# EAGLE design THAT15xx_lean_GainPot (EAGLE 9.6.2)
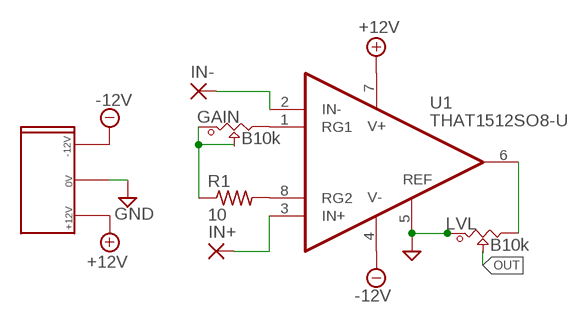
[diagram p0: schematic, sheet 1]

## Parts
GAIN  B10k  POT_9MM_SMD  [POT_9MM_SMD]
IN+  WIREPADSMD5-1,8  [5-1,8]
IN-  WIREPADSMD5-1,8  [5-1,8]
LVL  B10k  POT_9MM_SMD  [POT_9MM_SMD]
R1  10  R-US_R0603  [R0603]
U1  THAT1512SO8-U  [SO08]
U$1  EURO_POW_CEH  [EURO_POW_CEH]

## Nets
15XXO: LVL.3 U1.6(OUT)
+12V: U1.7(V+) U$1.+12V
-12V: U1.4(V-) U$1.-12V
GND: LVL.1 U1.5(REF) U$1.GND
IN+: IN+.1(P) U1.3(IN+)
IN-: IN-.1(P) U1.2(IN-)
N$1: R1.2 U1.8(RG2)
N$2: GAIN.3 U1.1(RG1)
N$3: GAIN.1 GAIN.2 R1.1
OUT: LVL.2

## Library data of the parts
GAIN LVL = Mech_BO_CE_SW:POT_9MM_SMD
IN+ IN- = wirepad:WIREPAD: Wire PAD connect wire on PCB
R1 = adafruit:R-US_: RESISTOR, American symbol
U1 = that-corp:THAT1512: Audio Preamplifier IC, Low Noise, High Performance
U$1 = 2.54mm_PowHeader_SMD:EURO_POW_CEH: Eurorack Power Header Reduced Card Edge Surface Mount Pads

## Board
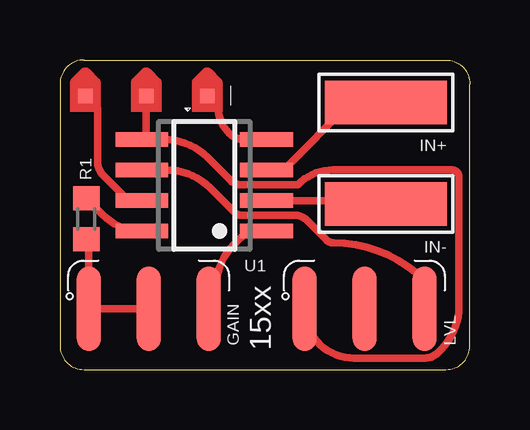
[diagram p1: board, top side]

Size 17.1 x 12.9 mm. Coordinates in mm from the lower left corner, seen from the top.
Outline: 1,12.9 16.1,12.9 arc-90 17.1,11.9 17.1,1 arc-90 16.1,0 1,0 arc-90 0,1 0,11.9 arc-90 1,12.9
Copper layers (1*16): Top 0.035mm / dielectric 1.5mm / Bottom 0.035mm
Design rules "default *": minimum track width 6mil, minimum drill 0.35mm, track to track 6mil, track to pad 6mil, pad to pad 6mil, via to via 6mil, smd to smd 6mil, copper to edge 10mil, drill to drill 6mil, minimum pad ring 10mil, minimum via ring 8mil, stop-mask expansion 4mil, vias tented up to drill 0mil, thermal gap 10mil

### Footprints (pad centres in the part's own frame; a part is rotated, then mirrored left to right if it is on the bottom)
POT_9MM_SMD = smd 0.991 x 3.505: 1 -2.5,0; 2 0,0; 3 2.5,0
5-1,8 = smd 1.829 x 5.08: 1 0,0
R0603 = smd 1 x 1.1: 1 -0.85,0; 2 0.85,0
SO08 = smd 0.6 x 2.2: 1 -1.905,-2.6; 2 -0.635,-2.6; 3 0.635,-2.6; 4 1.905,-2.6; 5 1.905,2.6; 6 0.635,2.6; 7 -0.635,2.6; 8 -1.905,2.6
EURO_POW_CEH = smd 0.6 x 0.6: +12V 0,-3.175; -12V 5.08,-3.175; GND 2.54,-3.175

### Placement (x,y rotation side)
GAIN  3.7,2.54 0 top
IN+  13.6,11.13 90 top
IN-  13.6,6.9 90 top
LVL  12.7,2.54 0 top
R1  1.1,6.28 90 top
U1  6.02,7.68 90 top
U$1  1.06,14.57 0 top

### Tracks (layer width: path | path; a pad name or v marks a point on that pad's centre or on a via)
15XXO
  Top 0.305: LVL.3 15.2,3.71 arc45 11.41,5.28 arc-45 11.11,5.4 10.28,6.24 arc45 9.78,6.44 7.52,6.44 arc-45 7.31,6.53 6.26,7.57 arc45 4.47,8.31 U1.6
+12V
  Top 0.305: U1.7 2.86,7.04 1.81,8.09 arc-45 1.57,8.68 1.57,10.89 U$1.+12V
-12V
  Top 0.305: U$1.-12V 6.6,10.94 arc45 7.05,9.85 arc45 7.69,9.59 U1.4
GND
  Top 0.305: U$1.GND 3.6,9.77 U1.5 4.36,9.59 arc-45 6.15,8.84 7.13,7.87 arc45 7.51,7.71 9.93,7.71 arc-45 11.39,8.32 16.34,8.32 arc-90 16.64,8.02 16.64,2.65 arc-45 15.9,0.85 15.74,0.69 arc-45 15.24,0.48 12.26,0.48 arc-90 LVL.1
IN+
  Top 0.305: U1.3 9.31,8.31 12.13,11.13 IN+.1
IN-
  Top 0.305: U1.2 13.46,7.04 IN-.1
N$1
  Top 0.305: R1.2 1.77,6.46 arc45 U1.8
N$2
  Top 0.305: U1.1 7.82,5.78 7.24,5.2 arc45 6.5,3.4 6.5,2.84 GAIN.3
N$3
  Top 0.305: R1.1 1.2,5.33 GAIN.1 GAIN.2

### Text on the board
tPlace: __ | 15xx